# EAGLE design pwm555 (EAGLE 9.0.0)
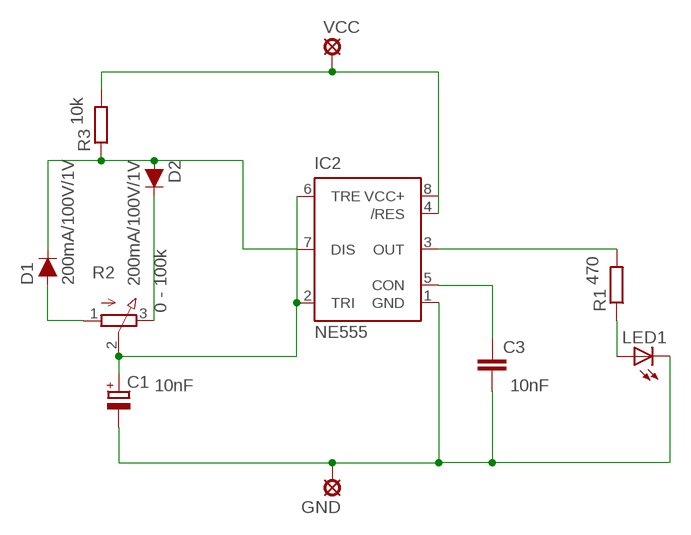
[diagram p0: schematic, sheet 1]

## Parts
C1  CPOL-EUE2.5-6  [E2,5-6]
C3  C-EU025-024X044  [C025-024X044]
D1  200mA/100V/1V  DIODE-1N4148  [DIODE-1N4148]
D2  200mA/100V/1V  DIODE-1N4148  [DIODE-1N4148]
GND  LSP10  [LSP10]
IC2  NE555  [DIL-08]
LED1  LED5MM  [LED5MM]
R1  R-EU_0207/10  [0207/10]
R2  3RP/1610N  [3RP/1610N]
R3  R-EU_0207/10  [0207/10]
VCC  LSP10  [LSP10]

## Nets
9V: IC2.4(/RES) IC2.8(VCC+) R3.2 VCC.MP
GND: C1.- C3.2 GND.MP IC2.1(GND) LED1.K(C)
N$1: LED1.A R1.1
N$2: IC2.3(OUT) R1.2
N$3: C3.1 IC2.5(CON)
N$5: C1.+ IC2.2(TRI) IC2.6(TRE) R2.2(S)
N$6: D1.A R2.1(A)
N$7: D2.C R2.3(E)
N$8: D1.C D2.A IC2.7(DIS) R3.1

## Library data of the parts
C1 = rcl:CPOL-EU: POLARIZED CAPACITOR, European symbol; C1: 10nF; SPICEPREFIX: C
C3 = rcl:C-EU: CAPACITOR, European symbol; C2: 10nF; SPICEPREFIX: C
D1 D2 = SparkFun-DiscreteSemi:DIODE: Diode These are standard reverse protection diodes and small signal diodes. SparkFun Products: SparkFun SparkPunk Sound Kit <https://www.sparkfun.com/products/11177> SparkFun ESP8266 Thing <https://www.sparkfun.com/products/13231>; PROD_ID: DIO-08378
GND VCC = solpad:LSP10: SOLDER PAD drill 1.0 mm, distributor Buerklin, 12H555
IC2 = st-microelectronics:NE555: General purpose bipolar Timer; MF: Arrow Electronics; MPN: NE555N; OC_FARNELL: 1467742; OC_NEWARK: 89K1486
LED1 = led:LED: LED OSRAM: - CHIPLED LG R971, LG N971, LY N971, LG Q971, LY Q971, LO R971, LY R971 LH N974, LH R974 LS Q976, LO Q976, LY Q976 LO Q996 - Hyper CHIPLED LW Q18S LB Q993, LB Q99A, LB R99A - SideLED LS A670, LO A670, LY A670, LG A670, LP A670 LB A673, LV A673, LT A673, LW A673 LH A674 LY A675 LS A676, LA A676, LO A676, LY A676, LW A676 LS A679, LY A679, LG A679 - Hyper Micro SIDELED® LS Y876, LA Y876, LO Y876, LY Y876 LT Y87S - SmartLED LW L88C, LW L88S LB L89C, LB L89S, LG L890 LS L89K, LO L89K, LY L89K LS L896, LA L896, LO L896, LY L896 - TOPLED LS T670, LO T670, LY T670, LG T670, LP T670 LSG T670, LSP T670, LSY T670, LOP T670, LYG T670 LG T671, LOG T671, LSG T671 LB T673, LV T673, LT T673, LW T673 LH T674 LS T676, LA T676, LO T676, LY T676, LB T676, LH T676, LSB T676, LW T676 LB T67C, LV T67C, LT T67C, LS T67K, LO T67K, LY T67K, LW E67C LS E67B, LA E67B, LO E67B, LY E67B, LB E67C, LV E67C, LT E67C LW T67C LS T679, LY T679, LG T679 LS T770, LO T770, LY T770, LG T770, LP T770 LB T773, LV T773, LT T773, LW T773 LH T774 LS E675, LA E675, LY E675, LS T675 LS T776, LA T776, LO T776, LY T776, LB T776 LHGB T686 LT T68C, LB T68C - Hyper Mini TOPLED® LB M676 - Mini TOPLED Santana® LG M470 LS M47K, LO M47K, LY M47K Source: http://www.osram.convergy.de LUXEON: - LUMILED® LXK2-PW12-R00, LXK2-PW12-S00, LXK2-PW14-U00, LXK2-PW14-V00 LXK2-PM12-R00, LXK2-PM12-S00, LXK2-PM14-U00 LXK2-PE12-Q00, LXK2-PE12-R00, LXK2-PE12-S00, LXK2-PE14-T00, LXK2-PE14-U00 LXK2-PB12-K00, LXK2-PB12-L00, LXK2-PB12-M00, LXK2-PB14-N00, LXK2-PB14-P00, LXK2-PB14-Q00 LXK2-PR12-L00, LXK2-PR12-M00, LXK2-PR14-Q00, LXK2-PR14-R00 LXK2-PD12-Q00, LXK2-PD12-R00, LXK2-PD12-S00 LXK2-PH12-R00, LXK2-PH12-S00 LXK2-PL12-P00, LXK2-PL12-Q00, LXK2-PL12-R00 Source: www.luxeon.com KINGBRIGHT: KA-3528ASYC Source: www.kingbright.com
R1 = resistor:R-EU_: RESISTOR, European symbol; R6: 470
R2 = pot:3RP/1610N: 16mm Potentiometer one level Source: http://www.alphapotentiometers.net/html/16mm_pot_2.html; POT1: 0 - 100k
R3 = resistor:R-EU_: RESISTOR, European symbol; R4: 10k

## Net classes
0 default: clearance 0.205 mm

## Board
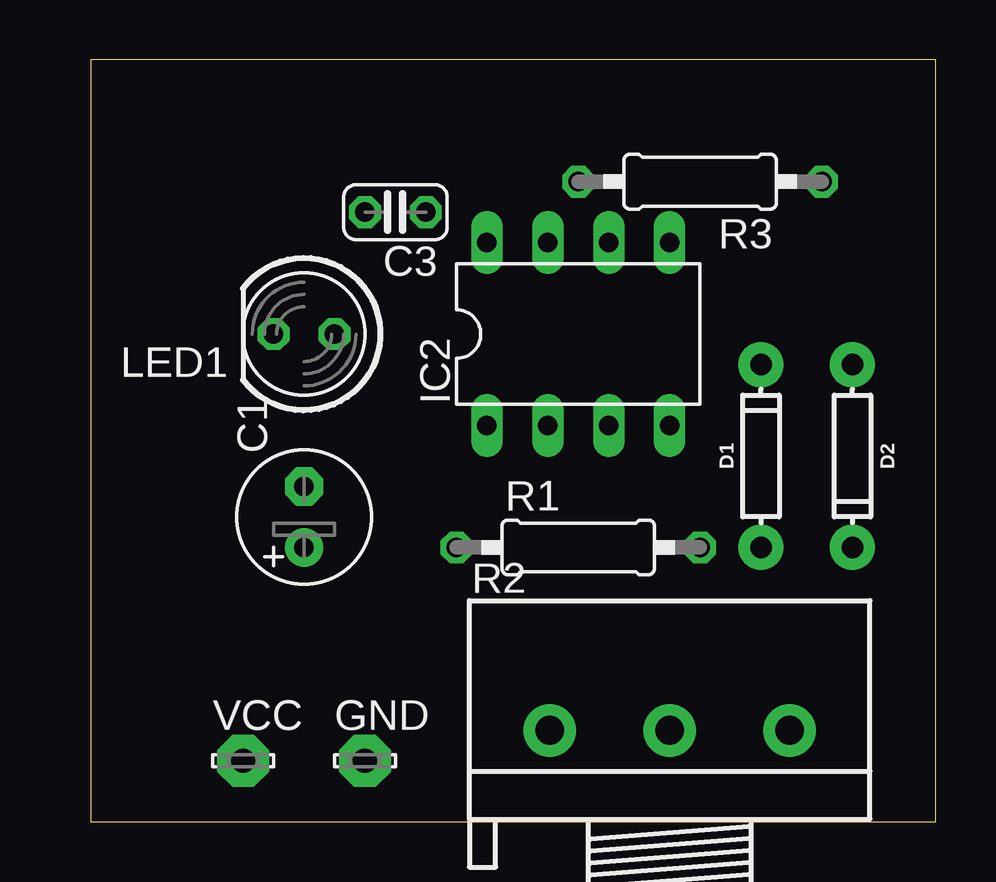
[diagram p1: board, top side]
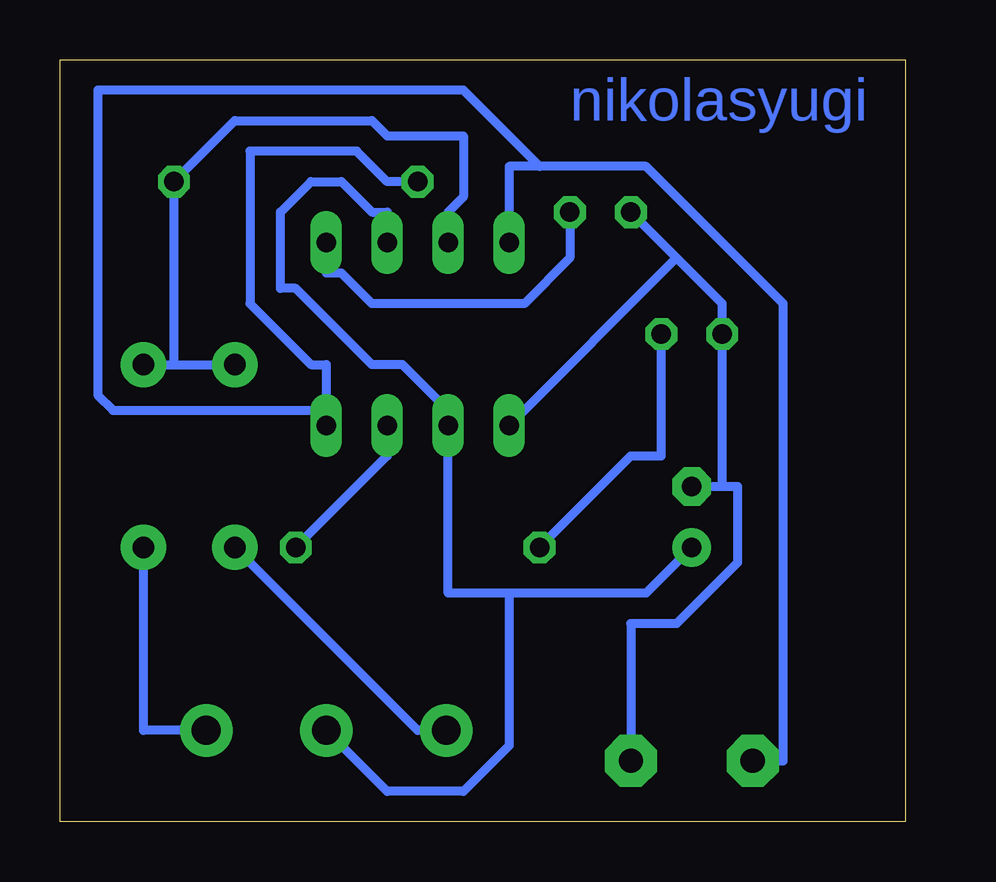
[diagram p2: board, bottom side, seen from below]

Size 35.23 x 31.74 mm. Coordinates in mm from the lower left corner, seen from the top.
Outline: 0,0 35.23,0 35.23,31.74 0,31.74 0,0
Copper layers (1*16): Top 0.035mm / dielectric 1.5mm / Bottom 0.035mm
Design rules "default *": minimum track width 15mil, minimum drill 0.35mm, track to track 30mil, track to pad 30mil, pad to pad 30mil, via to via 6mil, smd to smd 6mil, copper to edge 40mil, drill to drill 6mil, minimum pad ring 10mil, minimum via ring 8mil, stop-mask expansion 4mil, vias tented up to drill 0mil, thermal gap 10mil

### Footprints (pad centres in the part's own frame; a part is rotated, then mirrored left to right if it is on the bottom)
E2,5-6 = drill 0.813 pad 1.6: + -1.27,0 | drill 0.813 pad 1.6 octagon: - 1.27,0
C025-024X044 = drill 0.813 octagon: 1 -1.27,0; 2 1.27,0
DIODE-1N4148 = drill 0.9 pad 1.88: A -3.81,0; C 3.81,0
LSP10 = drill 1.016 pad 2.159 octagon: MP 0,0
DIL-08 = drill 0.813 long: 1 -3.81,-3.81; 2 -1.27,-3.81; 3 1.27,-3.81; 4 3.81,-3.81; 5 3.81,3.81; 6 1.27,3.81; 7 -1.27,3.81; 8 -3.81,3.81
LED5MM = drill 0.813 octagon: A -1.27,0; K 1.27,0
0207/10 = drill 0.813 octagon: 1 -5.08,0; 2 5.08,0
3RP/1610N = drill 1.2 pad 2.184: 1 -5,0; 2 0,0; 3 5,0

### Placement (x,y rotation side)
C1  8.89,12.7 90 top
C3  12.7,25.4 180 top
D1  27.94,15.24 90 top
D2  31.75,15.24 270 top
GND  11.43,2.54 0 top
IC2  20.32,20.32 0 top
LED1  8.89,20.32 180 top
R1  20.32,11.43 0 top
R2  24.13,3.81 0 top
R3  25.4,26.67 180 top
VCC  6.35,2.54 0 top

### Tracks (layer width: path | path; a pad name or v marks a point on that pad's centre or on a via)
9V
  Bottom 0.381: 24.13,17.14 24.13,19.05 24.77,19.05 27.3,21.59 27.3,27.94 22.86,27.94 21.59,26.67 R3.2 | IC2.8 16.51,27.3 15.24,27.3 | 15.24,27.3 10.79,27.3 5.08,21.59 5.08,2.54 VCC.MP | 24.13,17.14 33.02,17.14 33.66,17.78 33.66,30.48 18.41,30.48 15.24,27.3 | 24.13,17.14 IC2.4
GND
  Bottom 0.381: 7.62,13.97 LED1.K 7.62,21.59 9.53,23.5 | C1.- 7.62,13.97 | 9.53,23.5 C3.2 | 9.53,23.5 IC2.1 | GND.MP 11.43,8.26 9.53,8.26 6.99,10.79 6.99,13.97 7.62,13.97
N$1
  Bottom 0.381: LED1.A 10.16,15.24 11.43,15.24 R1.1
N$2
  Bottom 0.381: R1.2 21.59,15.24 IC2.3
N$3
  Bottom 0.381: IC2.5 24.13,22.86 23.5,22.86 22.23,21.59 15.88,21.59 13.97,23.5 C3.1
N$5
  Bottom 0.381: 16.51,9.53 10.79,9.53 C1.+ | 16.51,9.53 19.05,9.53 IC2.2 19.05,17.14 20.95,19.05 22.23,19.05 25.4,22.23 26.04,22.23 26.04,25.4 24.77,26.67 23.5,26.67 22.23,25.4 21.59,25.4 IC2.6 | R2.2 21.59,1.27 18.41,1.27 16.51,3.17 16.51,9.53
N$6
  Bottom 0.381: D1.A 20.32,3.81 R2.1
N$7
  Bottom 0.381: D2.C 31.75,3.81 R2.3
N$8
  Bottom 0.381: D2.A 30.48,19.05 | 30.48,19.05 D1.C | IC2.7 19.05,25.4 18.41,26.04 18.41,28.57 21.59,28.57 22.23,29.21 27.94,29.21 R3.1 30.48,19.05

### Text on the board
Bottom: nikolasyugi